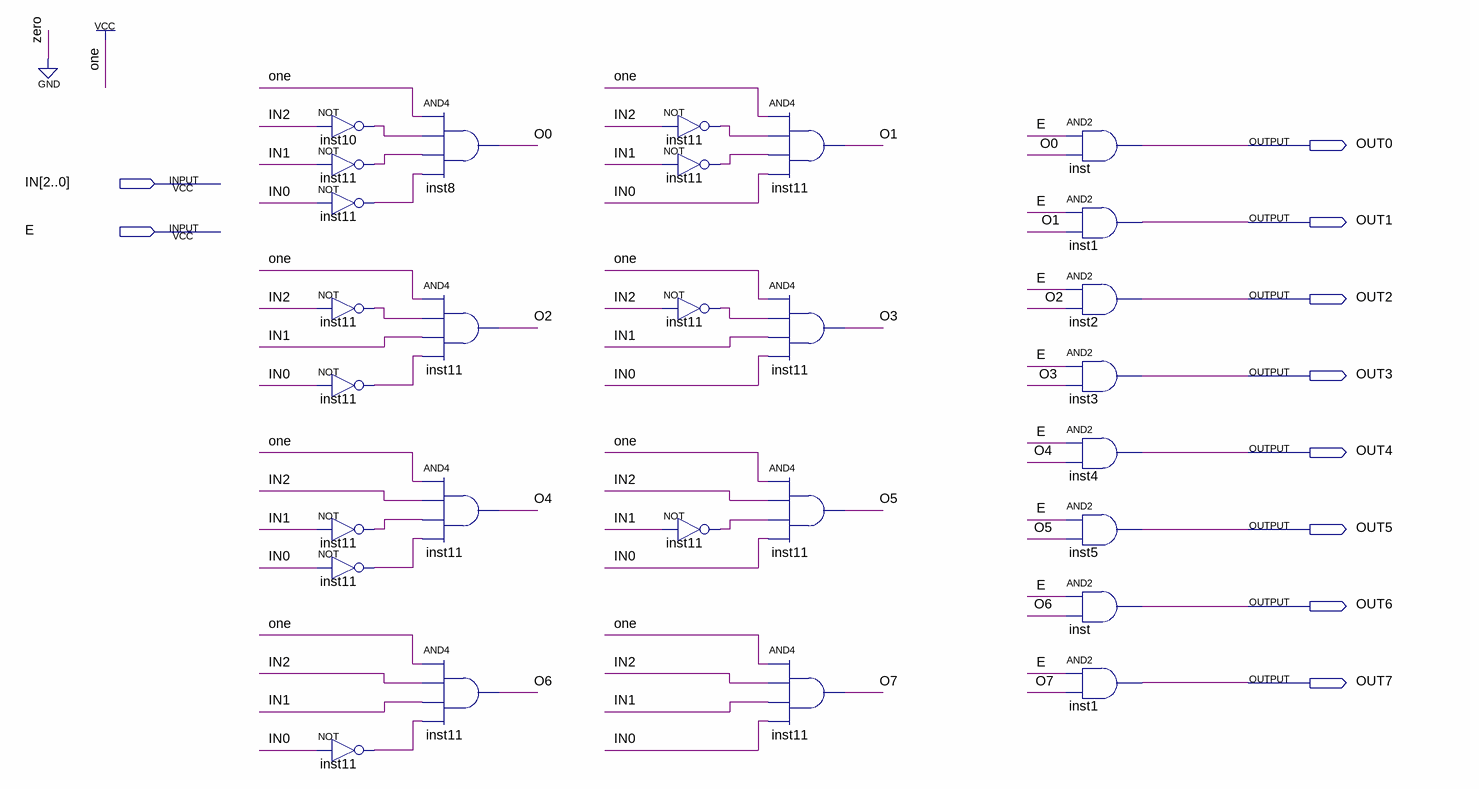
[diagram p0: schematic sheet]
// Quartus schematic decoder_3_bit.bdf as structural Verilog: 28 symbols, 10 pins
module decoder_3_bit (
  input  [2:0] IN,
  input  E,
  output OUT0,
  output OUT1,
  output OUT2,
  output OUT3,
  output OUT4,
  output OUT5,
  output OUT6,
  output OUT7
);

  wire inst10_out, inst11_out, inst11_out_2, inst11_out_3, inst11_out_4, inst11_out_5, inst11_out_6,
       inst11_out_7, inst11_out_8, inst11_out_9, inst11_out_10, inst11_out_11, O0, O1, O2, O3, O4, O5, O6, O7;

  not inst10 (inst10_out, IN[2]);
  not inst11 (inst11_out_2, IN[1]);
  not inst11_dup2 (inst11_out, IN[0]);
  not inst11_dup3 (inst11_out_6, IN[2]);
  not inst11_dup4 (inst11_out_5, IN[0]);
  not inst11_dup5 (inst11_out_8, IN[1]);
  not inst11_dup6 (inst11_out_7, IN[0]);
  not inst11_dup7 (inst11_out_9, IN[0]);
  and inst8 (O0, 1'b1, inst10_out, inst11_out_2, inst11_out);
  and inst11_dup8 (O2, 1'b1, inst11_out_6, IN[1], inst11_out_5);
  and inst11_dup9 (O4, 1'b1, IN[2], inst11_out_8, inst11_out_7);
  and inst11_dup10 (O6, 1'b1, IN[2], IN[1], inst11_out_9);
  not inst11_dup11 (inst11_out_4, IN[2]);
  not inst11_dup12 (inst11_out_3, IN[1]);
  not inst11_dup13 (inst11_out_10, IN[2]);
  not inst11_dup14 (inst11_out_11, IN[1]);
  and inst11_dup15 (O1, 1'b1, inst11_out_4, inst11_out_3, IN[0]);
  and inst11_dup16 (O3, 1'b1, inst11_out_10, IN[1], IN[0]);
  and inst11_dup17 (O5, 1'b1, IN[2], inst11_out_11, IN[0]);
  and inst11_dup18 (O7, 1'b1, IN[2], IN[1], IN[0]);
  and inst (OUT0, E, O0);
  and inst1 (OUT1, E, O1);
  and inst2 (OUT2, E, O2);
  and inst3 (OUT3, E, O3);
  and inst4 (OUT4, E, O4);
  and inst5 (OUT5, E, O5);
  and inst_dup2 (OUT6, E, O6);
  and inst1_dup2 (OUT7, E, O7);
endmodule
